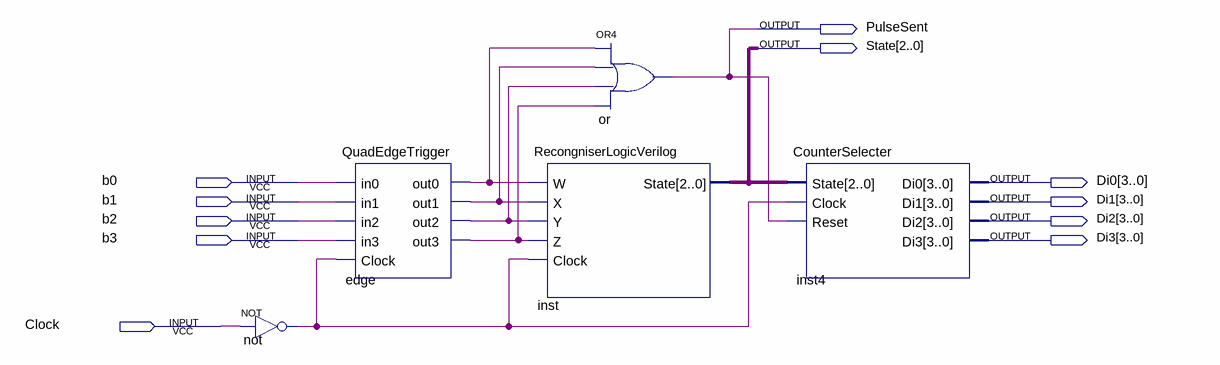
[diagram p0: schematic sheet]
// Quartus schematic CounterWithPassword.bdf as structural Verilog: 5 symbols, 11 pins
module CounterWithPassword (
  input  b0,
  input  b1,
  input  b2,
  input  b3,
  input  Clock,
  output PulseSent,
  output [2:0] State,
  output [3:0] Di0,
  output [3:0] Di1,
  output [3:0] Di2,
  output [3:0] Di3
);

  wire edge_out0, edge_out1, edge_out2, edge_out3, not_out;

  not \not  (not_out, Clock);
  QuadEdgeTrigger \edge  (
    .in0(b0), .in1(b1), .in2(b2), .in3(b3), .Clock(not_out), .out0(edge_out0), .out1(edge_out1),
    .out2(edge_out2), .out3(edge_out3));
  RecongniserLogicVerilog inst (
    .W(edge_out0), .X(edge_out1), .Y(edge_out2), .Z(edge_out3), .Clock(not_out), .State(State));
  or \or  (PulseSent, edge_out0, edge_out1, edge_out2, edge_out3);
  CounterSelecter inst4 (.State(State), .Clock(not_out), .Reset(PulseSent), .Di0(Di0), .Di1(Di1), .Di2(Di2), .Di3(Di3));
endmodule
